# EAGLE design nixie-in2-x3-nixieboard (EAGLE 5.04)
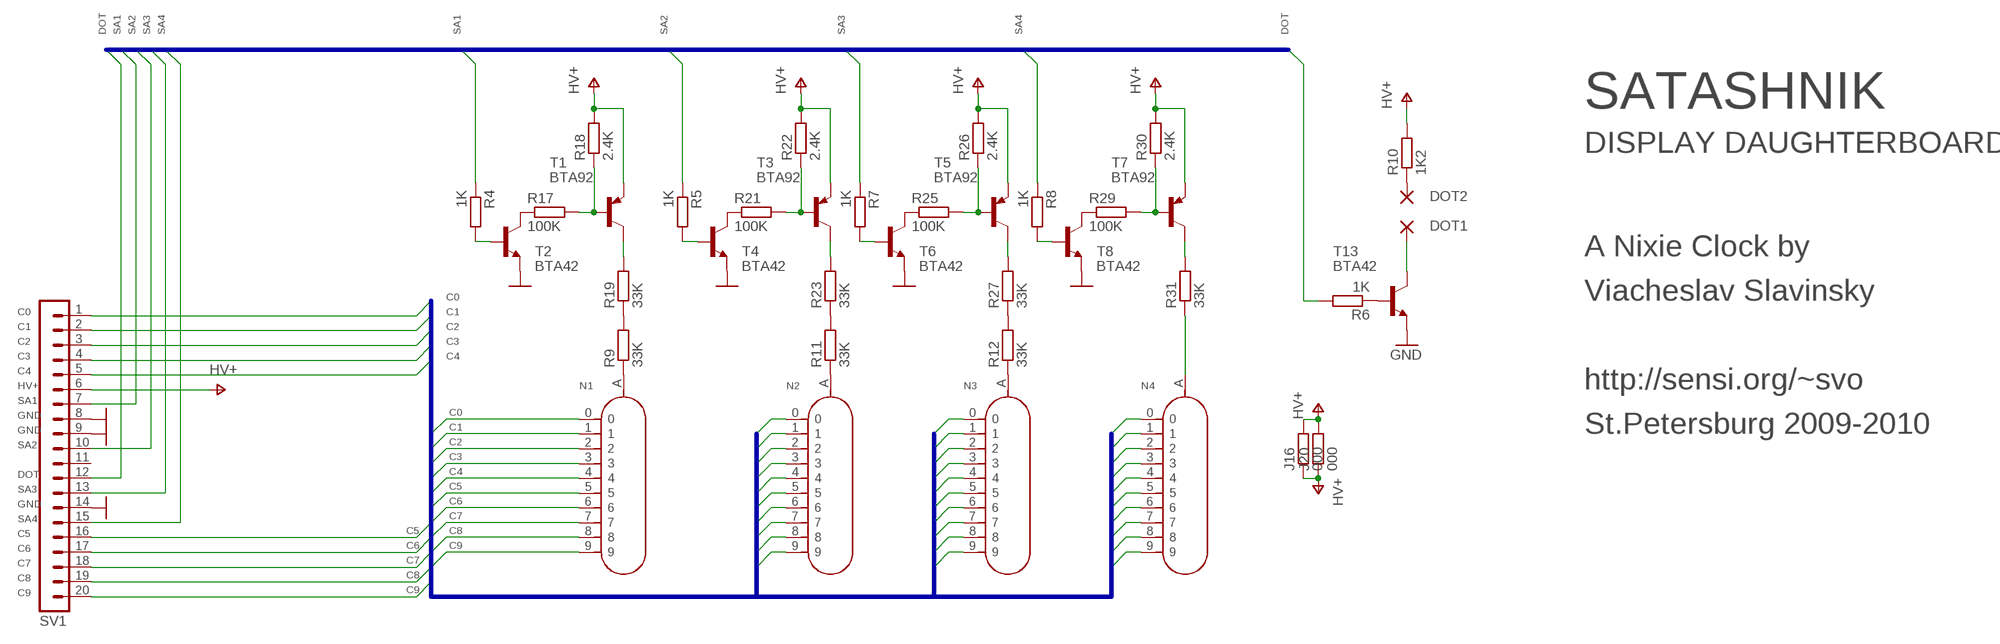
[diagram p0: schematic, sheet 1]

## Parts
DOT1  1,6/0,8  [1,6/0,8]
DOT2  1,6/0,8  [1,6/0,8]
J16  000  R-EU_R0805S  [R0805-SVO]
J20  000  R-EU_R0805S  [R0805-SVO]
N1  IN-2  [IN-2]
N2  IN-2  [IN-2]
N3  IN-2  [IN-2]
N4  IN-2  [IN-2]
R4  1K  R-EU_R0805S  [R0805-SVO]
R5  1K  R-EU_R0805S  [R0805-SVO]
R6  1K  R-EU_R0805S  [R0805-SVO]
R7  1K  R-EU_R0805S  [R0805-SVO]
R8  1K  R-EU_R0805S  [R0805-SVO]
R9  33K  R-EU_R0805S  [R0805-SVO]
R10  1K2  R-EU_R0805S  [R0805-SVO]
R11  33K  R-EU_R0805S  [R0805-SVO]
R12  33K  R-EU_R0805S  [R0805-SVO]
R17  100K  R-EU_R0805S  [R0805-SVO]
R18  2.4K  R-EU_R0805S  [R0805-SVO]
R19  33K  R-EU_R0805S  [R0805-SVO]
R21  100K  R-EU_R0805S  [R0805-SVO]
R22  2.4K  R-EU_R0805S  [R0805-SVO]
R23  33K  R-EU_R0805S  [R0805-SVO]
R25  100K  R-EU_R0805S  [R0805-SVO]
R26  2.4K  R-EU_R0805S  [R0805-SVO]
R27  33K  R-EU_R0805S  [R0805-SVO]
R29  100K  R-EU_R0805S  [R0805-SVO]
R30  2.4K  R-EU_R0805S  [R0805-SVO]
R31  33K  R-EU_R0805S  [R0805-SVO]
SV1  MA20-1W  [MA20-1W]
T1  BTA92  MMBTA92LT1-PNP-SOT23-BEC  [SOT23-BEC]
T2  BTA42  MMBTA42LT1-NPN-SOT23-BEC  [SOT23-BEC]
T3  BTA92  MMBTA92LT1-PNP-SOT23-BEC  [SOT23-BEC]
T4  BTA42  MMBTA42LT1-NPN-SOT23-BEC  [SOT23-BEC]
T5  BTA92  MMBTA92LT1-PNP-SOT23-BEC  [SOT23-BEC]
T6  BTA42  MMBTA42LT1-NPN-SOT23-BEC  [SOT23-BEC]
T7  BTA92  MMBTA92LT1-PNP-SOT23-BEC  [SOT23-BEC]
T8  BTA42  MMBTA42LT1-NPN-SOT23-BEC  [SOT23-BEC]
T13  BTA42  MMBTA42LT1-NPN-SOT23-BEC  [SOT23-BEC]

## Nets
C0: N1.0 N2.0 N3.0 N4.0 SV1.1
C1: N1.1 N2.1 N3.1 N4.1 SV1.2
C2: N1.2 N2.2 N3.2 N4.2 SV1.3
C3: N1.3 N2.3 N3.3 N4.3 SV1.4
C4: N1.4 N2.4 N3.4 N4.4 SV1.5
C5: N1.5 N2.5 N3.5 N4.5 SV1.16
C6: N1.6 N2.6 N3.6 N4.6 SV1.17
C7: N1.7 N2.7 N3.7 N4.7 SV1.18
C8: N1.8 N2.8 N3.8 N4.8 SV1.19
C9: N1.9 N2.9 N3.9 N4.9 SV1.20
DOT: R6.2 SV1.12
GND: SV1.8 SV1.9 SV1.14 T2.E T4.E T6.E T8.E T13.E
HV+: J16.1 J16.2 J20.1 J20.2 R10.2 R18.2 R22.2 R26.2 R30.2 SV1.6 T1.E T3.E T5.E T7.E
N$1: DOT2.1(P) R10.1
N$2: N4.A R31.1
N$4: R4.2 T2.B
N$5: R19.2 T1.C
N$6: N1.A R9.1
N$8: R5.2 T4.B
N$10: R9.2 R19.1
N$11: R21.2 R22.1 T3.B
N$12: R21.1 T4.C
N$13: R23.2 T3.C
N$14: N2.A R11.1
N$15: R7.2 T6.B
N$16: R25.2 R26.1 T5.B
N$17: R25.1 T6.C
N$18: R27.2 T5.C
N$19: R11.2 R23.1
N$20: R8.2 T8.B
N$21: R6.1 T13.B
N$22: R29.2 R30.1 T7.B
N$23: R29.1 T8.C
N$24: R31.2 T7.C
N$26: R17.2 R18.1 T1.B
N$27: N3.A R12.1
N$28: R12.2 R27.1
N$39: R17.1 T2.C
N$51: DOT1.1(P) T13.C
SA1: R4.1 SV1.7
SA2: R5.1 SV1.10
SA3: R7.1 SV1.13
SA4: R8.1 SV1.15
Unconnected: SV1.11

## Buses
C[0..9]
D[0..3],SA[1..4],DOT

## Notes on the sheet
- SATASHNIK
- DISPLAY DAUGHTERBOARD
- A Nixie Clock by
- Viacheslav Slavinsky
- http://sensi.org/~svo
- St.Petersburg 2009-2010

## Library data of the parts
DOT1 DOT2 = wirepad:1,6/0,8: THROUGH-HOLE PAD
J16 J20 R4-R12 R17-R19 R21-R23 R25-R27 R29-R31 = rcl:R-EU_: RESISTOR, European symbol
N1-N4 = 0-nixies-russian:IN-2: IN-2 Miniature Nixie Tube 19mm Dia, Top View Strike voltage: <200V Standby voltage: <100V Current: 1.5mA
SV1 = con-lstb:MA20-1W: PIN HEADER
T1 T3 T5 T7 = transistor:*-PNP-: PNP Transistror
T2 T4 T6 T8 T13 = transistor:*-NPN-: NPN Transistror

## Board
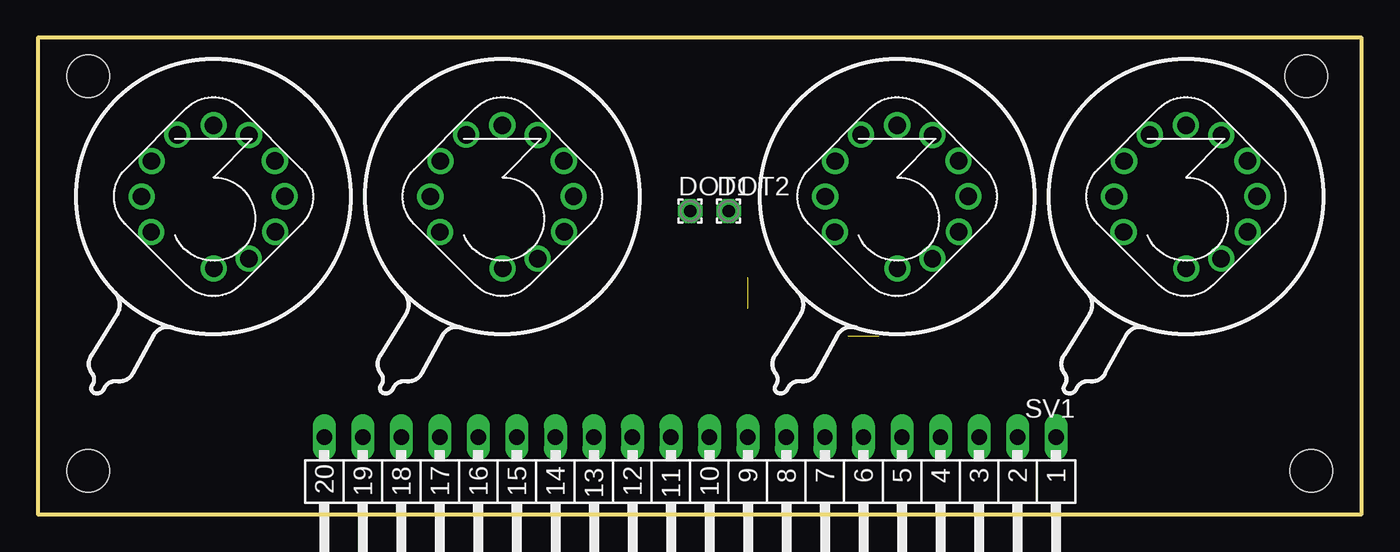
[diagram p1: board, top side]
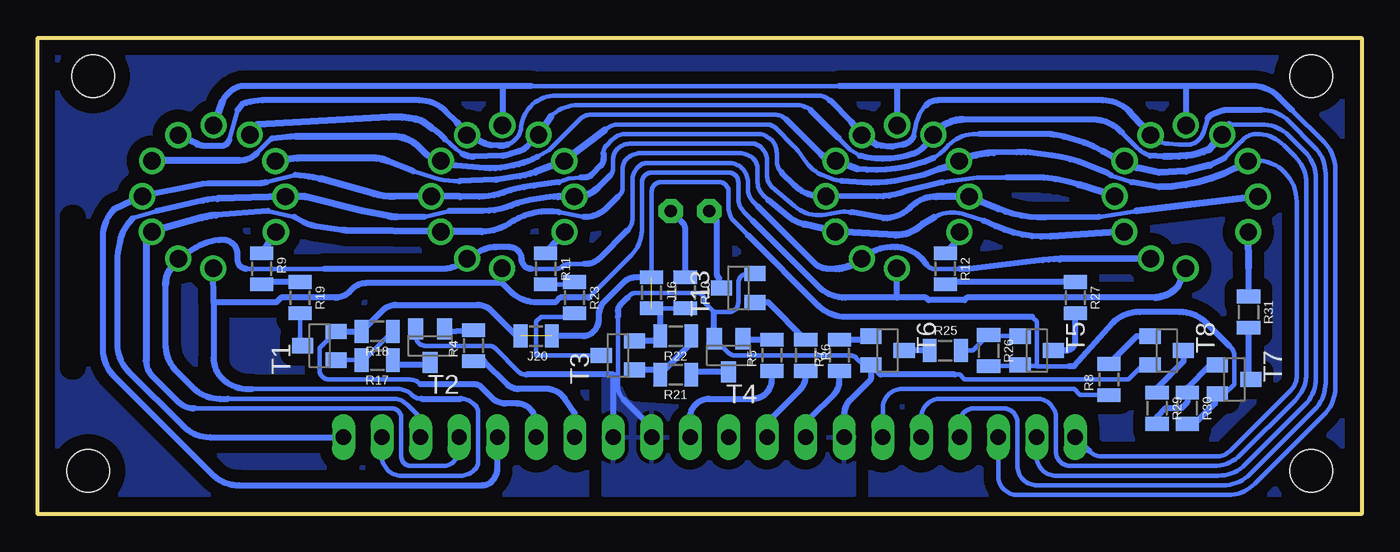
[diagram p2: board, bottom side, seen from below]

Size 87.3 x 31.42 mm. Coordinates in mm from the lower left corner, seen from the top.
Outline: 0,0 87.3,0 87.3,31.42 0,31.42 0,0
Copper layers (1*16): Top 0.035mm / dielectric 1.5mm / Bottom 0.035mm
Design rules "default *": minimum track width 10mil, minimum drill 24mil, track to track 10mil, track to pad 10mil, pad to pad 8mil, via to via 8mil, smd to smd 8mil, copper to edge 40mil, drill to drill 8mil, minimum pad ring 10mil, minimum via ring 8mil, stop-mask expansion 4mil, vias tented up to drill 0mil, thermal gap 10mil
Holes 2.8 mm at 3.33,2.85 3.33,28.89 83.66,28.89 83.97,2.85
tRestrict: area -0.5,60 to 12.5,73; area 66.8,30.2 to 72.9,35.2; area 58.3,25.1 to 78.6,27.6
bRestrict: area 84.9,9.7 to 85,19.6; area 85,9.7 to 85.1,19.6

### Footprints (pad centres in the part's own frame; a part is rotated, then mirrored left to right if it is on the bottom)
1,6/0,8 = drill 0.813 pad 1.6 octagon: 1 0,0
R0805-SVO = smd 0.9 x 1.524: 1 -1.027,0; 2 1.027,0
IN-2 = drill 1.15 round: 0 -4.745,0; 1 0.02,-4.735; 2 2.326,-4.089; 3 4.07,-2.32; 4 4.695,0.02; 5 4.052,2.363; 6 2.33,4.057; 7 0,4.705; 8 -2.388,4.081; 9 -4.082,2.343; A -4.11,-2.34
MA20-1W = drill 1.016 long: 1 -24.13,0; 2 -21.59,0; 3 -19.05,0; 4 -16.51,0; 5 -13.97,0; 6 -11.43,0; 7 -8.89,0; 8 -6.35,0; 9 -3.81,0; 10 -1.27,0; 11 1.27,0; 12 3.81,0; 13 6.35,0; 14 8.89,0; 15 11.43,0; 16 13.97,0; 17 16.51,0; 18 19.05,0; 19 21.59,0; 20 24.13,0
SOT23-BEC = smd 1 x 1.4: B -0.95,-1.1; C 0,1.1; E 0.95,-1.1

### Placement (x,y rotation side)
DOT1  43.02,20 0 top
DOT2  45.55,20 0 top
J16  46.83,14.6 270 bottom
J20  54.45,11.74 180 bottom
N1  75.72,20.95 0 top
N2  56.67,20.95 0 top
N3  30.63,20.95 0 top
N4  11.58,20.95 0 top
R4  58.57,11.11 90 bottom
R5  38.89,10.47 90 bottom
R6  36.66,10.47 270 bottom
R7  34.44,10.47 90 bottom
R8  16.66,8.88 90 bottom
R9  72.54,16.19 270 bottom
R10  44.6,14.6 270 bottom
R11  53.81,16.19 270 bottom
R12  27.46,16.19 270 bottom
R17  64.92,10.16 180 bottom
R18  64.92,12.06 180 bottom
R19  70,14.28 270 bottom
R21  45.24,9.2 180 bottom
R22  45.24,11.74 180 bottom
R23  51.91,14.28 270 bottom
R25  27.46,10.79 0 bottom
R26  24.6,10.79 270 bottom
R27  18.89,14.28 270 bottom
R29  13.49,6.98 270 bottom
R30  11.5,6.98 270 bottom
R31  7.46,13.33 270 bottom
SV1  43.02,5.08 180 top
T1  68.73,11.11 90 bottom
T2  61.43,11.11 180 bottom
T3  49.05,10.47 90 bottom
T4  41.74,10.47 180 bottom
T5  21.43,10.79 270 bottom
T6  31.27,10.79 270 bottom
T7  8.41,8.88 270 bottom
T8  12.85,10.79 270 bottom
T13  41.11,14.92 90 bottom

### Tracks (layer width: path | path; a pad name or v marks a point on that pad's centre or on a via)
C0
  Bottom 0.305: 49.55,22.35 arc-45 49.37,22.8 49.37,23.44 arc45 49.1,24.07 arc45 48.2,24.44 40.21,24.44 arc45 39.58,24.18 arc45 39.2,23.28 39.2,22.35 arc-45 38.89,21.58
  Bottom 0.306: 14.84,20 17.3,19.6 | 38.89,21.58 37.42,20.33 arc-51 35.32,19.77 34.59,19.91 arc21 33.66,19.91 | 60.16,20 61.83,19.6 | 79.45,20 81.04,19.52
  Bottom 0.406: SV1.1 75.95,5.08 arc45 77.72,5.81 81.34,9.42 arc45 82.07,11.19 82.07,16.64 arc11 81.97,17.63 81.89,18.04 arc31 81.28,19.24 81.04,19.52 | 28.06,20.95 arc-45 29.74,20.25 arc45 31.51,19.52 33.66,19.91 | 23.97,20.15 arc-24 20.84,19.57 17.3,19.6 | 51.78,20.95 N2.0 | 49.55,22.35 50.37,21.54 | 53.01,20.95 arc-9 53.8,20.89 54.85,20.72 arc-13 55.92,20.42 56.09,20.36 arc22 57.95,20 60.16,20 | 79.45,20 76.42,20.68 arc11 75.48,20.81 | 61.83,19.6 63.64,19.6
  Bottom 0.475: 28.06,20.95 N3.0 23.97,20.15 | N4.0 14.84,20 | 50.37,21.54 arc45 51.78,20.95 | N2.0 53.01,20.95 | 75.48,20.81 N1.0 69.69,20.95 65.88,20 64.14,19.65 arc-11 63.64,19.6
C1
  Bottom 0.305: SV1.2 64.61,3.81 arc-90 63.33,2.53 59.42,2.53 arc-45 58.52,2.91 arc-45 58.26,3.54 58.26,6.61 arc-45 58.52,7.24 arc-45 59.42,7.62 | 50.95,14.28 48.15,17.09 arc-45 47.46,18.94 47.46,21.9 arc90 46.83,22.54 41.74,22.54 arc90 41.11,21.9 41.11,20.84 arc-45 40.74,19.94 40.16,19.36 | 73.18,8.25 63.54,8.25 arc45 62.65,7.88 arc-45 62.01,7.62
  Bottom 0.406: 30.63,14.28 N3.1 | 75.72,13.97 N1.1 | 50.95,14.28 52.86,14.28 53.17,13.97 54.36,13.97 arc45 56.16,14.71 56.68,15.24 | 75.72,13.97 71.59,13.97 71.27,14.28 67.67,14.28 arc-45 66.77,14.65 66.56,14.86 arc45 65.67,15.24 56.68,15.24 | N2.1 56.68,15.24 | 13.59,14.28 26.03,14.28 26.19,14.12 28.57,14.12 28.73,14.28 30.63,14.28 | 75.72,13.97 75.72,10.28 arc-45 75.18,8.98 arc-45 73.41,8.25 73.18,8.25 | 62.01,7.62 59.42,7.62 | 30.63,14.28 34.04,14.28 arc45 35.81,15.01 40.16,19.36
  Bottom 0.475: N4.1 12.11,15.03 arc45 13.59,14.28
C2
  Bottom 0.305: 68.42,16.19 73.55,16.19 | 51.27,16.5 52.28,16.5 arc-45 52.73,16.32 arc45 53.04,16.19 54.76,16.19 | 48.41,18.73 arc-45 48.09,19.49 48.09,22.01 arc45 47.72,22.91 arc45 47.09,23.17 41.74,23.17 arc90 40.48,21.9 40.48,21.48 arc-45 40.1,20.58 39.84,20.31
  Bottom 0.306: 28.73,16.5 arc-45 28.28,16.19 26.51,16.19 | 74.77,7.62 63.86,7.62 arc45 62.96,7.24 62.06,6.35 SV1.3
  Bottom 0.406: 68.42,16.19 60.53,16.19 arc-40 59.26,16.64 N2.2 58.14,17.34 arc14 57.71,17.52 57.65,17.54 arc16 57.1,17.62 56.19,17.62 arc90 55.4,16.82 arc-90 54.76,16.19 | N3.2 33.07,16.64 | 74.77,7.62 75.32,7.62 arc45 77.08,8.35 78.16,9.42 arc45 78.89,11.19 78.89,15.13 | 48.41,18.73 50.26,16.88 arc45 51.16,16.5 51.27,16.5 | 39.84,20.31 36.08,16.56 arc-45 35.19,16.19 34.69,16.19 | N3.2 33.07,16.77 | 28.73,16.5 arc-56 30.8,17.62 arc-34 32.41,17.23 N3.2 | 78.34,16.45 N1.2 76.85,17.59 arc32 75.08,18.09 arc90 74.13,17.14 74.13,16.77 arc-90 73.55,16.19 | 26.51,16.19 25.87,16.19 21.03,16.76 arc6 19.92,16.83
  Bottom 0.475: 33.07,16.77 arc40 34.69,16.19 | 78.34,16.45 arc-45 78.89,15.13 | N4.2 19.92,16.83
C3
  Bottom 0.305: SV1.4 59.53,4.44 arc90 60.48,3.17 62.7,3.17 arc90 63.33,3.81 63.33,6.35 arc-90 63.97,6.98 76.99,6.98 | 49.05,20.95 48.92,21.08 arc-45 48.73,21.53 48.73,22.8 arc45 48.47,23.43 arc45 47.57,23.81 41,23.81 arc45 40.1,23.43 arc45 39.84,22.8 39.84,21.95 arc-45 39.47,21.05 39.13,20.71
  Bottom 0.306: 51.29,19.6 52.92,19.92 | 24.92,19.36 26.16,19.78 arc-48 28.2,19.57 | 70.4,19.6 72.15,20
  Bottom 0.406: 52.92,19.92 arc-45 56.25,19.14 arc31 58.01,18.64 | 49.05,20.95 49.89,20.1 arc45 51.29,19.6 | 76.99,6.98 arc45 78.07,7.43 79.75,9.11 arc45 80.16,10.11 | 24.92,19.36 24.13,19 arc-28 20.5,18.32 | 39.13,20.71 37.81,19.64 arc-26 36.79,19.13 | 80.16,18.09 79.9,18.35 arc-45 N1.3 | 66.98,18.72 arc7 67.3,18.75 68.92,18.98 arc20 69.77,19.26 70.4,19.6 | 72.15,20 75.56,19.72
  Bottom 0.475: 28.2,19.57 28.95,19.14 arc45 30.72,18.41 N3.3 36.79,19.13 | N4.3 20.5,18.32 | 58.01,18.64 N2.3 66.98,18.72 | 80.16,18.09 80.16,10.11 | 75.56,19.72 arc-11 76.5,19.55 N1.3
C4
  Bottom 0.305: 50,23.81 50,23.86 arc45 49.81,24.31 49.42,24.7 arc45 48.52,25.08 39.84,25.08 arc90 38.57,23.81 38.57,23.3 arc-45 38.25,22.54
  Bottom 0.306: 23.41,22.22 24.9,22.22 arc-8 25.59,22.17 27.62,21.9 | 51.48,22.22 52.3,22.14 52.94,21.9 | 70.32,22.38 72.22,21.9
  Bottom 0.406: SV1.5 56.98,3.06 arc45 57.36,2.16 arc45 57.99,1.9 74.05,1.9 arc45 75.81,2.63 82.29,9.11 arc45 83.02,10.87 83.02,18.33 arc45 82.29,20.09 | 50,23.81 50,23.43 arc45 50.19,22.99 50.77,22.41 arc45 51.22,22.22 51.48,22.22 | 38.25,22.54 37.41,21.7 arc-46 35.61,20.97 N3.4 31.95,20.95 arc-23 30.03,21.33 27.62,21.9 | 52.94,21.9 54.6,21.66 55.27,21.57 arc-10 56.14,21.36 56.61,21.21 arc18 58.19,20.95 59.45,20.95 | 68.7,22.12 arc-8 69.41,22.27 70.32,22.38 | 72.22,21.9 arc18 72.71,21.82 75.76,21.82 arc-12 76.77,21.72 N1.4 | 23.41,22.22 21.73,22.22 arc18 18.66,21.74
  Bottom 0.475: N1.4 82.29,20.09 | 59.45,20.95 N2.4 63.78,20.95 arc16 65.15,21.14 68.7,22.12 | N4.4 18.66,21.74
C5
  Bottom 0.305: 9.76,3.17 arc-45 7.99,3.9 4.38,7.52 arc-45 3.64,9.29 3.64,21.82 arc-45 4.38,23.59 5.14,24.34 arc-45 6.9,25.08 arc-45 7.85,24.69 8.09,24.44 | 37.94,26.03 arc-45 38.7,26.35 50.82,26.35 arc-45 51.59,26.03
  Bottom 0.306: 51.59,26.03 53.6,24.02 54.36,23.58 | 25.2,25.08 25.45,25.08 arc-45 27.25,24.33 27.28,24.3 arc11 27.51,24.06 27.8,23.79 28.22,23.5 | 71.91,24.76 72.86,23.81 | 8.09,24.44 9.04,23.49 | 9.76,3.17 19.2,3.17 arc90 20.16,4.12 20.16,6.35 arc-90 21.43,7.62 27.77,7.62 arc-90 29.05,6.35 SV1.16
  Bottom 0.406: N2.5 61.26,23.5 | 35.64,23.74 37.94,26.03 | 54.36,23.58 arc19 55.9,23.02 56.46,22.91 arc16 57.84,22.84 59.69,23 arc14 59.99,23.06 | 70.28,24.92 arc-5 70.87,24.88 71.91,24.76 | 72.86,23.81 arc45 74.01,23.33 | 33.25,22.78 arc-16 30.72,22.81 29.92,22.93 28.81,23.25 28.22,23.5 | 17.04,23.92 arc-20 20.29,25.04 arc-9 20.83,25.08 25.2,25.08 | N4.5 15.54,23.28 | 9.04,23.49 9.99,23.01
  Bottom 0.475: 61.26,23.5 arc26 61.74,23.8 62.13,24.19 arc-45 63.89,24.92 70.28,24.92 | 35.64,23.74 arc-42 N3.5 34.48,23.23 33.25,22.78 | 59.99,23.06 N2.5 | 74.01,23.33 N1.5 | 17.04,23.92 16.45,23.59 N4.5 14.84,22.86 13.33,22.54 11.58,22.62 9.99,23.01
C6
  Bottom 0.305: 9.13,1.9 arc-45 7.36,2.63 3.11,6.88 arc-45 2.38,8.65 2.38,22.45 arc-45 3.11,24.22 4.82,25.93 arc-45 6.59,26.66 | 35.08,27.3 arc-45 35.84,27.62 52.41,27.62
  Bottom 0.306: N4.6 13.51,24.7 arc-37 12.74,24.44 12.06,24.36 11.57,24.36 arc-21 11.13,24.44 arc-44 10.51,25 10.39,25.25 10.15,26.11 | 28.73,26.98 arc-67 28.73,26.98 | 28.73,26.98 arc-33 29.35,25.85 29.55,24.91 | 56.3,24.39 arc-52 55.45,25.36 arc90 53.1,27.62 52.41,27.62 | 74.13,26.66 74.69,24.68 | 9.13,1.9 21.43,1.9 arc90 22.7,3.17 22.7,6.03 arc-90 23.65,6.98 25.55,6.98 arc-90 26.51,6.03 SV1.17
  Bottom 0.406: 59.67,25.86 60.38,26.57 arc-45 62.15,27.3 72.5,27.3 arc-21 73.81,27.06 74.13,26.66 | 33.63,25.86 35.08,27.3 | 15.3,26.57 arc-45 17.07,27.3 27.96,27.3 arc-45 28.73,26.98 | 56.3,24.39 56.33,24.38 arc24 56.86,24.3 57.39,24.34 arc21 57.83,24.46 | 74.69,24.68 arc72 75.24,24.28 76.23,24.28 arc25 76.77,24.4 | 31.98,24.36 arc-12 30.95,24.24 30.24,24.36 arc-32 29.65,24.74 29.55,24.91 | 6.59,26.66 8.84,26.66 arc-18 9.24,26.6 9.72,26.44 arc-38 10.15,26.11
  Bottom 0.475: 59.67,25.86 N2.6 57.83,24.46 | N4.6 15.3,26.57 | 33.63,25.86 N3.6 31.98,24.36 | 76.77,24.4 N1.6
C7
  Bottom 0.305: 34.44,28.25 54.76,28.25 | 21.34,1.27 8.81,1.27 arc-45 7.04,2 2.47,6.57 arc-45 1.74,8.33 1.74,22.77 arc-45 2.47,24.54 4.6,26.66
  Bottom 0.306: 21.34,1.27 22.7,1.27 arc90 23.96,2.53 SV1.18
  Bottom 0.406: 56.67,28.25 73.92,28.25 arc-45 75.14,27.25 | 30.63,28.25 N3.7 | 56.67,28.25 N2.7 | 30.63,28.25 34.44,28.25 | 54.76,28.25 56.67,28.25 | 11.58,28.25 30.63,28.25 | 11.58,28.25 N4.7 | 11.58,28.25 7.22,28.25 arc45 5.45,27.52 4.6,26.66
  Bottom 0.475: 75.14,27.25 N1.7
C8
  Bottom 0.305: N2.8 53.89,25.63 | 72.82,25.71 N1.8 | 9.44,2.53 arc-45 7.68,3.27 3.74,7.2 arc-45 3.01,8.97 3.01,22.14 arc-45 3.74,23.9 4.82,24.98 arc-45 6.59,25.71 8.72,25.71 | 53.47,26.25 arc45 51.7,26.98 37.43,26.98 arc45 36.35,26.66
  Bottom 0.306: 9.19,25.24 N4.8 9.67,24.55 | 34.5,24.81 33.73,24.05 33.09,23.65 | 60.45,24.74 59.72,24.08 59.29,23.77 | 13.96,23.65 arc27 14.79,24.16 15.81,25.17 | 9.44,2.53 20.16,2.53 arc90 21.43,3.81 SV1.19
  Bottom 0.406: 15.81,25.17 15.93,25.3 arc-45 17.7,26.03 26.27,26.03 | 34.5,24.81 36.35,26.66 | 60.45,24.74 arc-21 61.33,25.45 | N2.8 55.01,24.28 arc28 55.55,23.95 56.34,23.7 arc16 56.68,23.64 58.59,23.58 arc34 59.29,23.77 | 33.09,23.65 arc-35 29.55,23.78 arc-33 28.72,24.4 N3.8 | 13.03,23.6 13.96,23.65
  Bottom 0.475: 53.47,26.25 N2.8 | 26.27,26.03 arc-54 N3.8 | 8.72,25.71 9.19,25.24 | 72.82,25.71 64.16,26.19 arc24 61.97,25.92 61.33,25.45 | 10.07,24.05 arc18 11.57,23.65 arc9 13.03,23.6
  Bottom 0.5: N4.8 10.07,24.05
C9
  Bottom 0.305: 49.91,25.34 arc45 49.01,25.71 39.2,25.71
  Bottom 0.306: 39.2,25.71 arc45 38.66,25.49 37.44,24.26 arc9 37.19,23.97 36.62,23.2 arc-33 35.47,22.33 34.8,22.07 34.28,21.98 | N4.9 arc101 4.28,20.63 4.28,9.09 arc45 4.65,8.2 8.67,4.18 arc45 9.57,3.81 17.09,3.81 arc45 17.99,4.18 | 59.51,21.97 arc19 61.19,22.2 62.54,22.62 | 15.15,21.9 16.53,22.34
  Bottom 0.406: 62.54,22.62 64.23,23.3 | 54.51,22.56 arc12 55.52,22.3 56.99,22.07 arc7 57.14,22.06 59.51,21.97 | 34.28,21.98 32.86,21.89 arc-12 30.79,21.98 28.89,22.38 27.85,22.78 | 24.28,23.84 22.74,23.88 arc5 21.86,23.86 20.41,23.66 arc14 18.07,23.04 16.82,22.54 16.53,22.34 | 13.36,21.58 15.15,21.9 | 17.99,4.18 SV1.20
  Bottom 0.475: 49.91,25.34 N2.9 54.51,22.56 | 27.85,22.78 arc-22 N3.9 arc24 24.28,23.84 | 64.23,23.3 arc-22 65.18,23.49 69.95,23.49 arc-9 70.69,23.43 N1.9 | N4.9 arc32 13.36,21.58
DOT
  Bottom 0.305: R6.2 36.74,9.45
  Bottom 0.306: 36.66,9.09 R6.2
  Bottom 0.406: SV1.12 39.2,5.5 arc45 38.83,6.4 37.04,8.2 arc-45 36.66,9.09
GND
  Bottom 0.305: T4.E 41.78,10.66 arc-45 41.33,10.47 33.75,10.47 arc45 33.3,10.29 32.86,9.84 T6.E 32.38,9.83 | T2.E 62.38,11.74 arc-90 61.75,11.11 57.57,11.11 arc45 57.12,10.92 55.58,9.39 arc-45 55.13,9.2 55.08,9.2 | 48.41,14.28 48.28,14.41 arc45 47.83,14.6 43.65,14.6 43.33,14.28 43.33,13.97 42.7,13.33 | 49.05,13.01 49.05,9.2 49.37,9.2 | 42.7,13.33 41.74,13.33 arc-90 41.11,13.97 41.11,15.23 arc90 40.48,15.87 T13.E | 42.7,13.33
  Bottom 0.306: 49.05,9.2 49.05,8.65 49.05,8.46 arc-45 48.68,7.56 | 46.83,5.18 SV1.9 | T8.E 14.44,9.84 15.39,8.88 26.19,8.88 26.51,9.2 26.82,9.2
  Bottom 0.406: 48.41,14.28 48.86,13.83 arc-45 49.05,13.38 49.05,13.01 | 55.08,9.2 49.37,9.2 SV1.8 | T4.E 42.7,13.33 | SV1.14 34.13,6.61 arc45 33.75,7.51 32.37,8.9 T6.E 31.73,9.2 26.82,9.2 | 46.83,5.18 arc-45 47.2,6.08 48.68,7.56
  pour Bottom (isolate 0.61): 33.49,6.35 48.09,7.3 arc90 48.73,9.2 50,8.88 50,1.27 33.49,1.27
HV+  (2 unrouted)
  Bottom 0.305: T1.E 68.73,10.96 68.73,9.52 arc-90 68.1,8.88 62.83,8.88 arc45 62.06,8.57 | R22.2 46.27,11.42 | T5.E 22.28,9.76 R26.2 21.5,9.76 21.43,9.76 21.43,12.7 21.74,13.01 | 8.72,11.11 8.59,10.98 arc45 8.41,10.53 8.41,8.57 9.04,7.93 T7.E 9.58,7.86 | J16.1 46.83,21.27 arc90 46.19,21.9 42.38,21.9 arc90 41.74,21.27 41.74,20.21 arc-45 41.37,19.31 40.48,18.41 | R10.2 46.19,13.57 | 46.19,13.57 J16.2 | 46.19,13.57 46.26,13.5 | 55.72,11.74 J20.2
  Bottom 0.306: 19.28,9.76 21.43,9.76
  Bottom 0.406: T1.E R18.2 64.58,13.43 arc45 63.68,13.81 58.3,13.81 arc45 57.41,13.43 55.72,11.74 | 46.27,11.42 T3.E | 8.72,11.11 10.2,12.59 arc-45 12,13.33 14.66,13.33 arc-45 16.45,12.59 18.96,9.76 19.28,9.76 | 46.26,13.5 R22.2 | J16.1 47.81,15.63 arc-45 48.71,15.26 49.95,14.02 arc-45 50.32,13.12 50.32,12.9 arc45 50.69,12.01 arc45 51.32,11.74 J20.1 | 21.74,13.01 34.04,13.01 arc45 35.81,13.74 40.48,18.41 | R30.2 11.02,5.95 9.68,7.3 9.68,7.77 T7.E | SV1.6 54.45,6.03 arc-90 55.72,7.3 56.46,7.3 arc45 57.36,7.67 57.88,8.2 arc-45 58.46,8.57 62.06,8.57
N$1
  Bottom 0.406: R10.1 44.6,18.78 arc-45 44.79,19.23 DOT2.1
N$2
  Bottom 0.406: R31.1 7.46,16.25
  Bottom 0.475: 7.46,16.25 N4.A
N$4
  Bottom 0.305: 60.48,11.99 T2.B
  Bottom 0.406: R4.2 60.48,11.99
N$5
  Bottom 0.305: R19.2 70,11.28 T1.C
N$6
  Bottom 0.475: R9.1 72.32,17.53 N1.A
N$8
  Bottom 0.305: 40.8,11.35 T4.B 40.72,11.5
  Bottom 0.406: R5.2 40.72,11.5
N$10
  Bottom 0.305: 72.39,15.31 R9.2
  Bottom 0.406: R19.1 72.39,15.31
N$11
  Bottom 0.305: R21.2 46.58,9.52 | 44.21,11.26 R22.1
  Bottom 0.406: 46.58,9.52 T3.B | 44.21,11.26 R21.2
N$12
  Bottom 0.305: 44.04,9.37 R21.1
  Bottom 0.406: T4.C 44.04,9.37
N$13
  Bottom 0.305: T3.C 54.45,10.47 54.45,12.7 54.13,13.01 52.15,13.01 R23.2
N$14
  Bottom 0.475: R11.1 52.95,18.17 N2.A
N$15
  Bottom 0.305: 32.44,11.82 T6.B 32.61,11.5
  Bottom 0.406: 32.61,11.5 R7.2
N$16
  Bottom 0.305: R25.2 25.63,10.79 R26.1 24.52,11.74 T5.B
N$17
  Bottom 0.406: R25.1 T6.C
N$18
  Bottom 0.406: T5.C 19.52,10.79 arc-90 18.89,11.43 R27.2
N$19
  Bottom 0.305: R11.2 52.05,15.16 R23.1
N$20
  Bottom 0.406: T8.B 14.83,11.74 R8.2
N$21
  Bottom 0.406: T13.B 39.13,13.97 R6.1
N$22
  Bottom 0.406: R29.2 13.49,6.42 12.93,6.98 11.9,6.98 11.5,7.38 R30.1 | R30.1 | R30.1 11.5,8.33 9.99,9.84 T7.B
N$23
  Bottom 0.406: R29.1 13.49,8.33 11.74,10.08 11.74,10.78 T8.C
N$24
  Bottom 0.305: T7.C 7.46,9.03
  Bottom 0.406: 7.46,9.03 R31.2
N$26
  Bottom 0.305: T1.B 66.27,10.16 R17.2 65.95,10.01 R18.1
N$27
  Bottom 0.475: R12.1 26.47,18.2 N3.A
N$28
  Bottom 0.305: 27.31,15.31 R12.2
  Bottom 0.406: R27.1 27.31,15.31
N$39
  Bottom 0.305: T2.C 61.6,9.84 | 63.58,9.84 R17.1
  Bottom 0.406: 61.6,9.84 63.58,9.84
N$51
  Bottom 0.305: T13.C 42.38,15.09
  Bottom 0.406: DOT1.1 42.71,19.7 arc45 42.53,19.25 42.53,15.91 arc-45 42.38,15.55 42.38,15.09
N$C
  pour Bottom (isolate 0.813, rank 6): -0.48,31.75 -0.48,-0.64 87.78,-0.64 87.78,32.06 -0.48,32.06
SA1
  Bottom 0.406: R4.1 57.86,10.08 56.33,8.54 arc-45 55.62,8.25 53.59,8.25 arc45 52.56,7.64 51.91,6.66 SV1.7
SA2
  Bottom 0.406: SV1.10 44.28,6.35 arc90 43.02,7.62 40.16,7.62 arc-90 38.89,8.88 R5.1
SA3
  Bottom 0.305: R7.1 34.52,9.45
  Bottom 0.406: 34.44,9.2 R7.1 34.44,8.78 arc45 34.81,7.88 36.29,6.4 arc-45 36.66,5.5 SV1.13
SA4
  Bottom 0.306: SV1.15 31.59,6.98 arc90 30.31,8.25 18.96,8.25 18.57,7.86 R8.1

### Text on the board
SMD1: 2009
SMD16: SATASHNIK